# EasyEDA Pro project ProProject_触摸水晶小夜灯_2024-02-28.epro

# Schematic Schematic1
Create Date: 2024-02-10; Page Name: P1; Project Name: 触摸水晶灯; Schematic Name: Schematic1; Update Date: 2024-02-10; Company: 嘉立创EDA; Page Size: A4; Version: V1.0
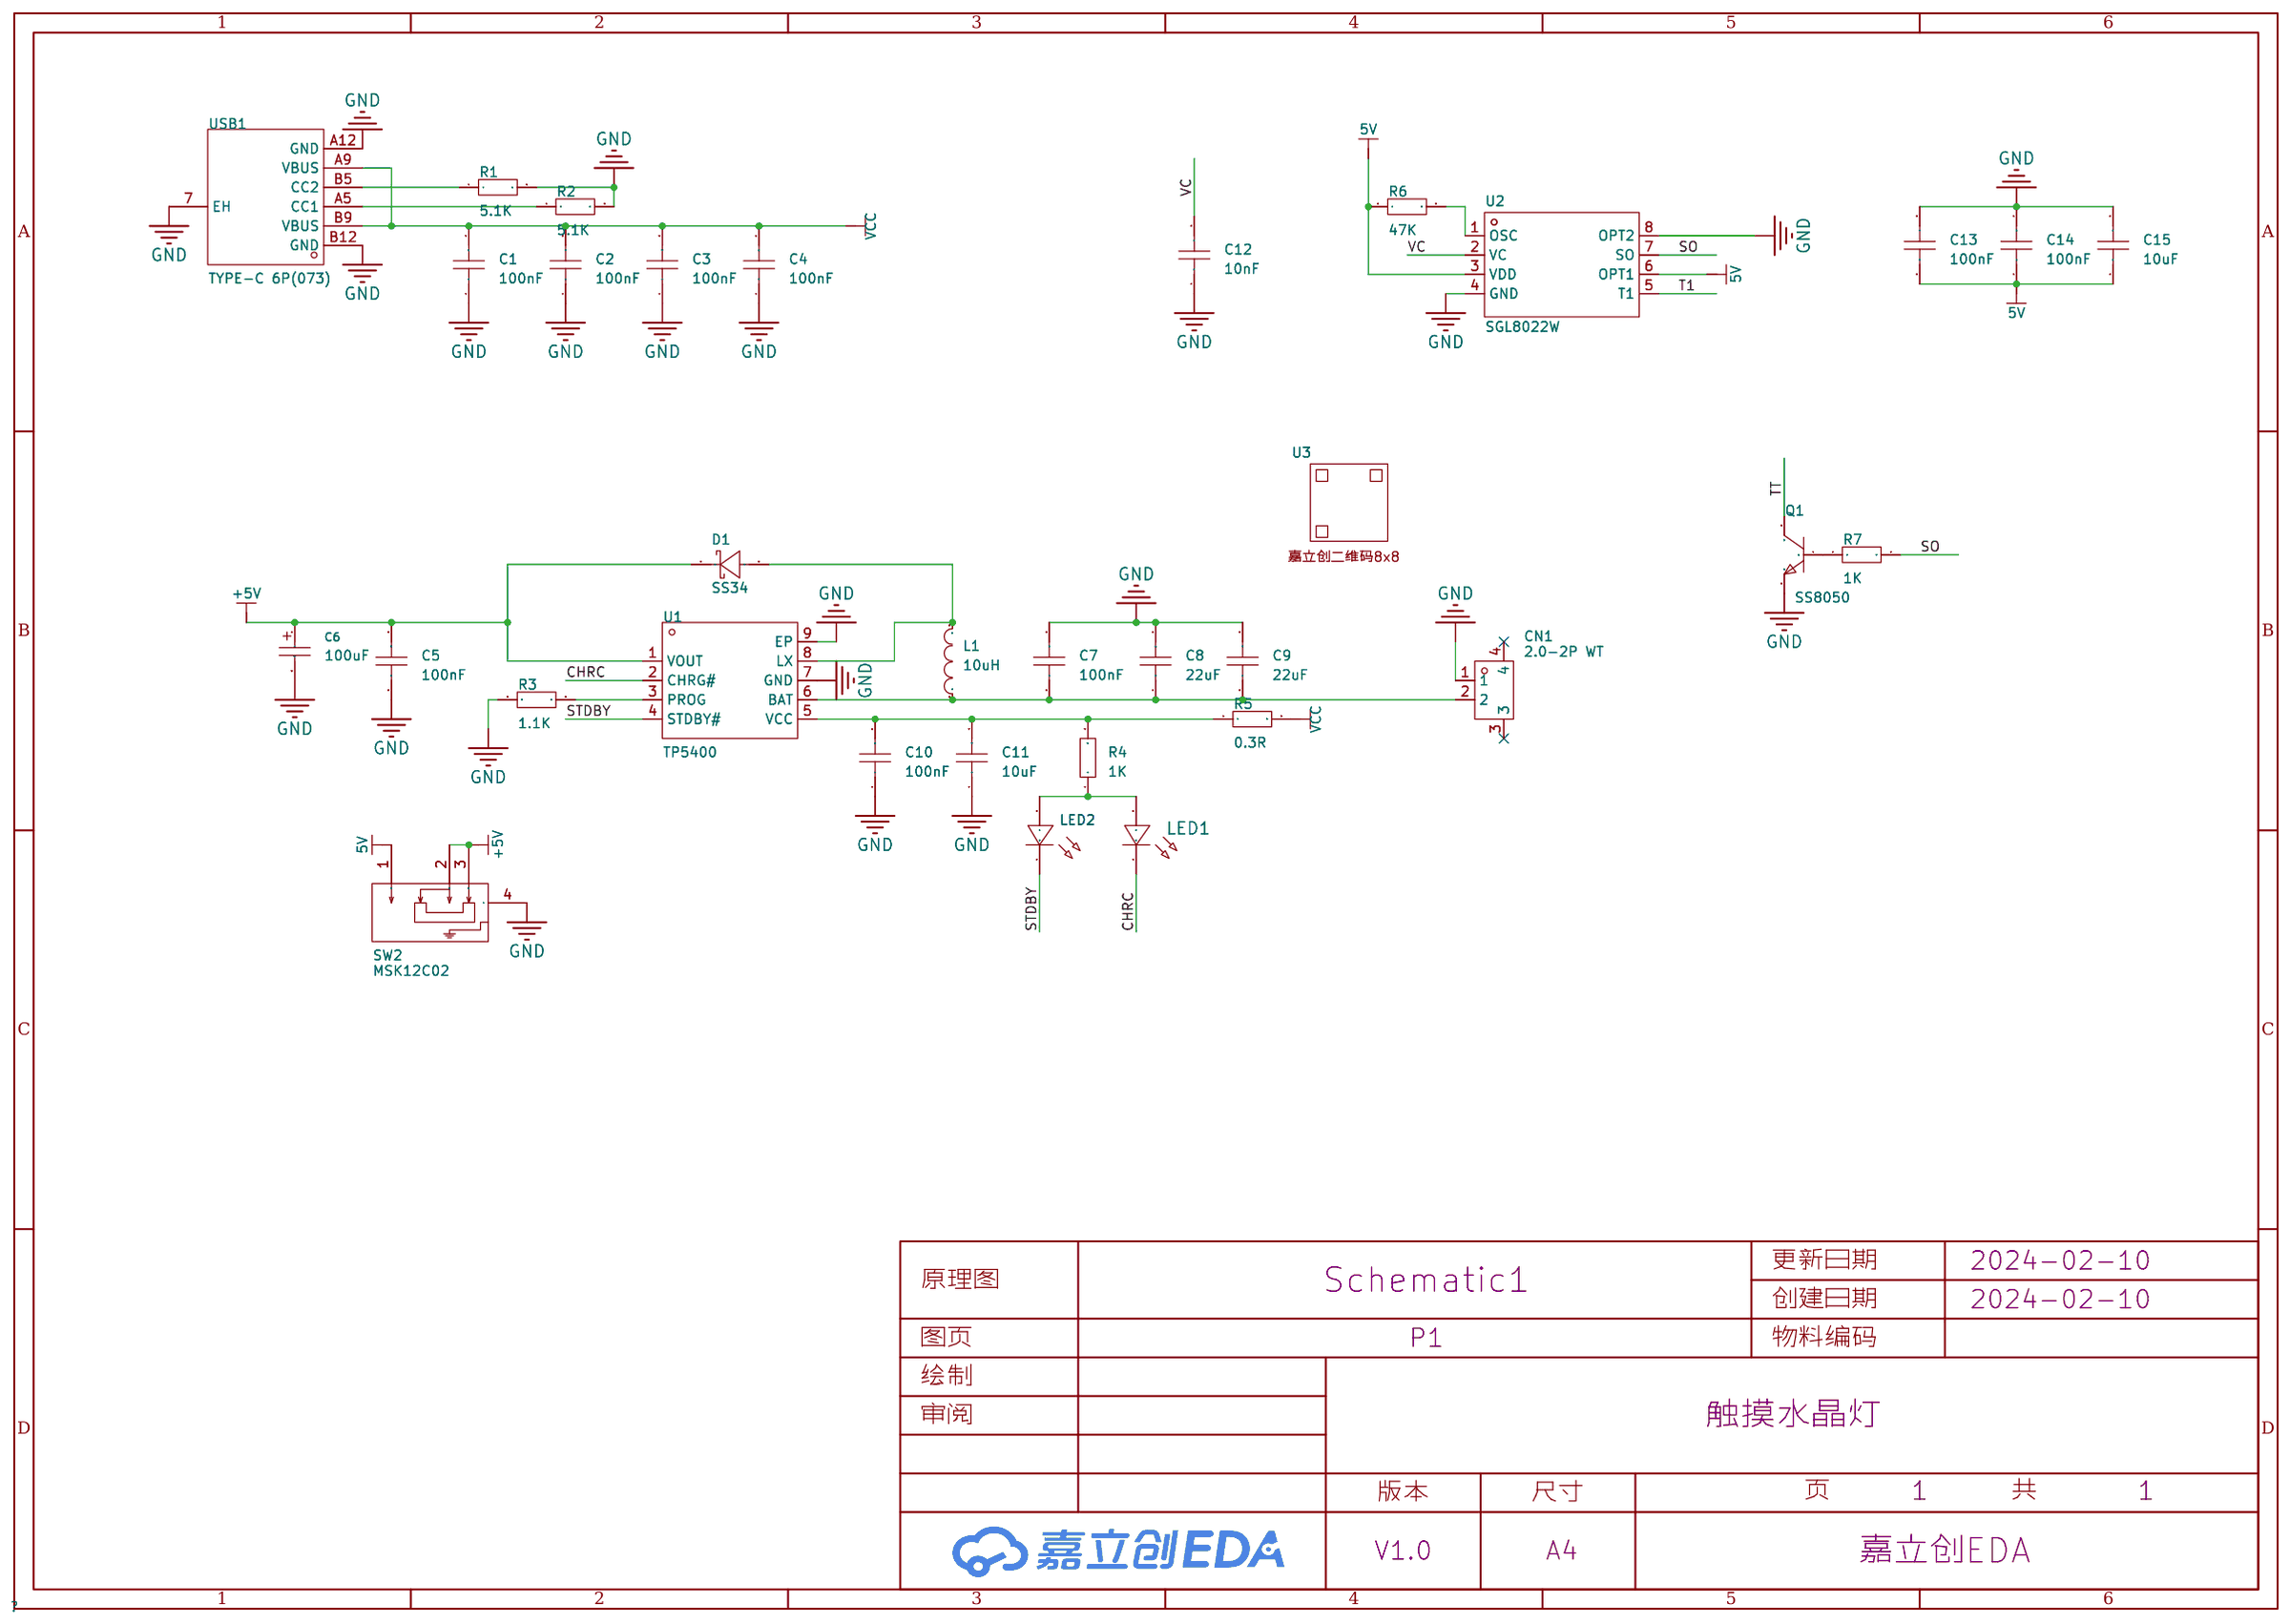
[diagram p0: schematic sheet]

## Parts
C1  100nF  [C0603]
C2  100nF  [C0603]
C3  100nF  [C0603]
C4  100nF  [C0603]
C5  100nF  [C0603]
C6  100uF  [CASE-B_3528]
C7  100nF  [C0603]
C8  22uF  [C0603]
C9  22uF  [C0603]
C10  100nF  [C0603]
C11  10uF  [C0603]
C12  10nF  [C0603]
C13  100nF  [C0603]
C14  100nF  [C0603]
C15  10uF  [C0603]
CN1  2.0-2P WT  [CONN-SMD_2.0-2PWT]
D1  SS34  [SMA_L4.3-W2.5-LS5.0-RD]
L1  10uH  [IND-SMD_L4.4-W4.2]
LED1  -  [LED_0603]
LED2  -  [LED_0603]
Q1  SS8050  [SOT-23-3_L2.9-W1.3-P1.90-LS2.4-BR]
R1  5.1K  [R0603]
R2  5.1K  [R0603]
R3  1.1K  [R0603]
R4  1K  [R0603]
R5  0.3R  [R0603]
R6  47K  [R0603]
R7  1K  [R0603]
SW2  MSK12C02  [SW-TH_MSK12C02]
U1  TP5400  [ESOP-8_L4.9-W3.9-P1.27-LS6.0-BL-EP]
U2  SGL8022W  [SOP-8_L4.9-W3.9-P1.27-LS6.0-BL]
U3  -  [JLC-QRCODE-8x8]
USB1  TYPE-C 6P(073)  [TYPE-C-SMD_TYPE-C-6P]

## Library data of the parts
C1-C5 C7-C15 = CAP_0603: Supplier Footprint: 0603
C6 = TAJB107K006RNJ: 容值:100uF;精度:±10%;额定电压:6.3V;等效串联电阻:1.7Ω@100kHz;; LCSC Part Name: 100uF ±10% 6.3V; Supplier Part: C16133; Manufacturer: Kyocera AVX; Supplier Footprint: CASE-B-3528; JLCPCB Part Class: 基础库; Datasheet: https://atta.szlcsc.com/upload/public/pdf/source/20160107/1457707750344.pdf; Supplier: LCSC; Tolerance: ±10%; Rated Voltage: 6.3V; Equivalent Series Resistance(ESR): 1.7Ω@100kHz; Operating Temperature: -55℃~+125℃
CN1 = 2.0-2P WT: 插针结构:1x2P;间距:2mm;安装方式:卧贴;参考系列:-;总PIN数:2P;排数:1;每排PIN数:2;行距:-;额定电流:2A;工作温度范围:-25℃~+85℃;; LCSC Part Name: 1x2P 间距:2mm 卧贴; Supplier Part: C668620; Manufacturer: SHOU HAN(首韩); Supplier Footprint: SMD,P=2mm,卧贴; JLCPCB Part Class: 扩展库; Datasheet: https://atta.szlcsc.com/upload/public/pdf/source/20200618/C668620_23A1268D02446CDAEF4211C80D6A413F.pdf; Supplier: LCSC; Pins Structure: 1x2P; Pitch: 2mm; Mounting Style: 卧贴; Number of Pins: 2P; Number of Rows: 1; Number of PINs Per Row: 2; Current Rating (Max): 2A; Operating Temperature Range: -25℃~+85℃
D1 = SS34_C727060: 二极管配置:独立式;正向压降(Vf):550mV@3A;直流反向耐压(Vr):40V;平均整流电流(Io):3A;; LCSC Part Name: 电压:40V 电流:3A; Supplier Part: C727060; Manufacturer: TWGMC(台湾迪嘉); Supplier Footprint: SMA(DO-214AC); JLCPCB Part Class: Extended Part; Datasheet: https://atta.szlcsc.com/upload/public/pdf/source/20200828/C727059_6599B6CAC5F3238B9C33E46794659DBE.pdf; Supplier: LCSC; Diode Configuration: 独立式; Forward Voltage (Vf@If): 550mV@3A; Reverse Voltage (Vr): 40V; Average Rectified Current (Io): 3A; Reverse Leakage Current (Ir): 500uA@40V
L1 = FXL0420-100-M: 电感值:10uH;精度:±20%;额定电流:1.6A;饱和电流(Isat):2.2A;类型:一体成型电感;; LCSC Part Name: 10uH ±20% 2.2A; Supplier Part: C177242; Manufacturer: cjiang(长江微电); Supplier Footprint: SMD,4.2x4.4mm; JLCPCB Part Class: 扩展库; Datasheet: https://atta.szlcsc.com/upload/public/pdf/source/20200117/C485363_A2440626DC7482D75DD0DD56D1883FBF.pdf; Supplier: LCSC; Tolerance: ±20%; Rated Current: 1.6A; Saturation Current (Isat): 2.2A; DC Resistance (DCR): 282mΩ; Type: 一体成型电感
LED1 = LED_0603-R: Supplier Footprint: 0603
LED2 = LED_0603-G: Supplier Footprint: 0603
Q1 = SS8050_C2150: 晶体管类型:NPN;集电极电流(Ic):1.5A;集射极击穿电压(Vceo):25V;功率(Pd):300mW;直流电流增益(hFE@Ic,Vce):200@100mA,1V;; LCSC Part Name: NPN 电流:1.5A 耐压:25V hfe=200~350; Supplier Part: C2150; Manufacturer: CJ(江苏长电/长晶); Supplier Footprint: SOT-23; JLCPCB Part Class: Basic Part; Datasheet: https://atta.szlcsc.com/upload/public/pdf/source/20230322/AEE86F4B043774EFF80CAEA14A37D9E9.pdf; Supplier: LCSC; Transistor Type: NPN; Collector Current (Ic): 1.5A; Collector-Emitter Breakdown Voltage (Vceo): 25V; Power Dissipation (Pd): 300mW; DC Current Gain (hFE@Ic,Vce): 200@100mA,1V; Transition Frequency (fT): 100MHz; Collector Cut-Off Current (Icbo): 100nA; Collector-Emitter Saturation Voltage (VCE(sat)@Ic,Ib): 500mV@800mA,80mA
R1-R7 = Res_0603: Supplier Footprint: 0603
SW2 = MSK12C02: 电路结构:单刀双掷;安装方式:卧贴;开关颜色:-;额定电流(DC):50mA;额定电压(DC):12V;额定电流(AC):-;额定电压(AC):-;机械寿命:1万次;; LCSC Part Name: 两档侧拨贴片 7脚 滑动开关; Supplier Part: C431540; Manufacturer: SHOU HAN(首韩); Supplier Footprint: SMD; JLCPCB Part Class: 扩展库; Datasheet: https://atta.szlcsc.com/upload/public/pdf/source/20190925/C431540_89155AEF0758B9AD1B2D805F83FB12E3.pdf; Supplier: LCSC; Circuit: 单刀双掷; Pin Style: SMD接片; Switch Length: 8mm; Switch Width: 2.8mm; Switch Height: 1.4mm; Mounting Style: 卧贴; Current Rating (DC): 50mA; Voltage Rating (DC): 12V; Mechanical Life: 1万次; Operating Temperature: -20℃~+70℃
U1 = TP5400: Supplier Part: C2891434; Manufacturer: TOPPOWER(南京拓微); Supplier Footprint: ESOP-8; JLCPCB Part Class: 扩展库; Datasheet: https://atta.szlcsc.com/upload/public/pdf/source/20210909/352D9D40D77A1DD73F7904E364EF004B.pdf; Supplier: LCSC
U2 = SGL8022W: 通道数:1;; Supplier Part: C81650; Manufacturer: SIGMA(希格玛); Supplier Footprint: SOP-8; JLCPCB Part Class: 扩展库; Datasheet: https://atta.szlcsc.com/upload/public/pdf/source/20170620/1497944870793.pdf; Supplier: LCSC; The Channel Number: 1
U3 = 嘉立创二维码8x8
USB1 = TYPE-C 6P(073): 连接器类型:Type-C;标准:-;公母:母;端口数量:1;触点数量:6P;安装方式:卧贴;额定电流 - 电源:5A;工作温度范围:-25℃~+85℃;; LCSC Part Name: Type-C 母 卧贴; Supplier Part: C668623; Manufacturer: SHOU HAN(首韩); Supplier Footprint: SMD; JLCPCB Part Class: 扩展库; Datasheet: https://atta.szlcsc.com/upload/public/pdf/source/20200618/C668623_A4B260DED7AC1949BAC6AE39E9F4CD80.pdf; Supplier: LCSC; Connector Type: Type-C; Gender: 母; Number of Ports: 1; Number of Contacts: 6P; Mounting Style: 卧贴; Current Rating - Power (Max): 5A; Operating Temperature Range: -25℃~+85℃

## Nets
5V: C13.1 C14.1 C15.1 R6.1 SW2.1 U2.3(VDD) U2.6(OPT1)
+5V: C5.2 C6.1 D1.1(C) SW2.2 SW2.3 U1.1(VOUT)
GND: C1.1 C2.1 C3.1 C4.1 C5.1 C6.2 C7.2 C8.2 C9.2 C10.1 C11.1 C12.1 C13.2 C14.2 C15.2 CN1.1 Q1.2(E) R1.2 R2.2 R3.1 SW2.4 U1.7(GND) U1.9(EP) U2.4(GND) U2.8(OPT2) USB1.7(EH) USB1.A12(GND) USB1.B12(GND)
VCC: C1.2 C2.2 C3.2 C4.2 R5.2 USB1.A9(VBUS) USB1.B9(VBUS)
CHRC: LED1.1(C) U1.2(CHRG#)
SO: R7.2 U2.7(SO)
STDBY: LED2.1(C) U1.4(STDBY#)
T1: U2.5(T1)
TT: Q1.3(C)
VC: C12.2 U2.2(VC)
$1N577: R1.1 USB1.B5(CC2)
$1N583: R2.1 USB1.A5(CC1)
$1N1194: R3.2 U1.3(PROG)
$1N1614: D1.2(A) L1.2 U1.8(LX)
$1N1820: C7.1 C8.1 C9.1 CN1.2 L1.1 U1.6(BAT)
$1N2082: C10.2 C11.2 R4.2 R5.1 U1.5(VCC)
$1N2235: LED1.2(A) LED2.2(A) R4.1
$1N2524: R6.2 U2.1(OSC)
$1N3000: Q1.1(B) R7.1

Not connected (* = marked no-connect by the designer): CN1 3* 4*

# Schematic Schematic2
Create Date: 2024-02-11; Page Name: P1; Project Name: 触摸水晶灯; Schematic Name: Schematic2; Update Date: 2024-02-11; Company: 嘉立创EDA; Page Size: A4; Version: V1.0
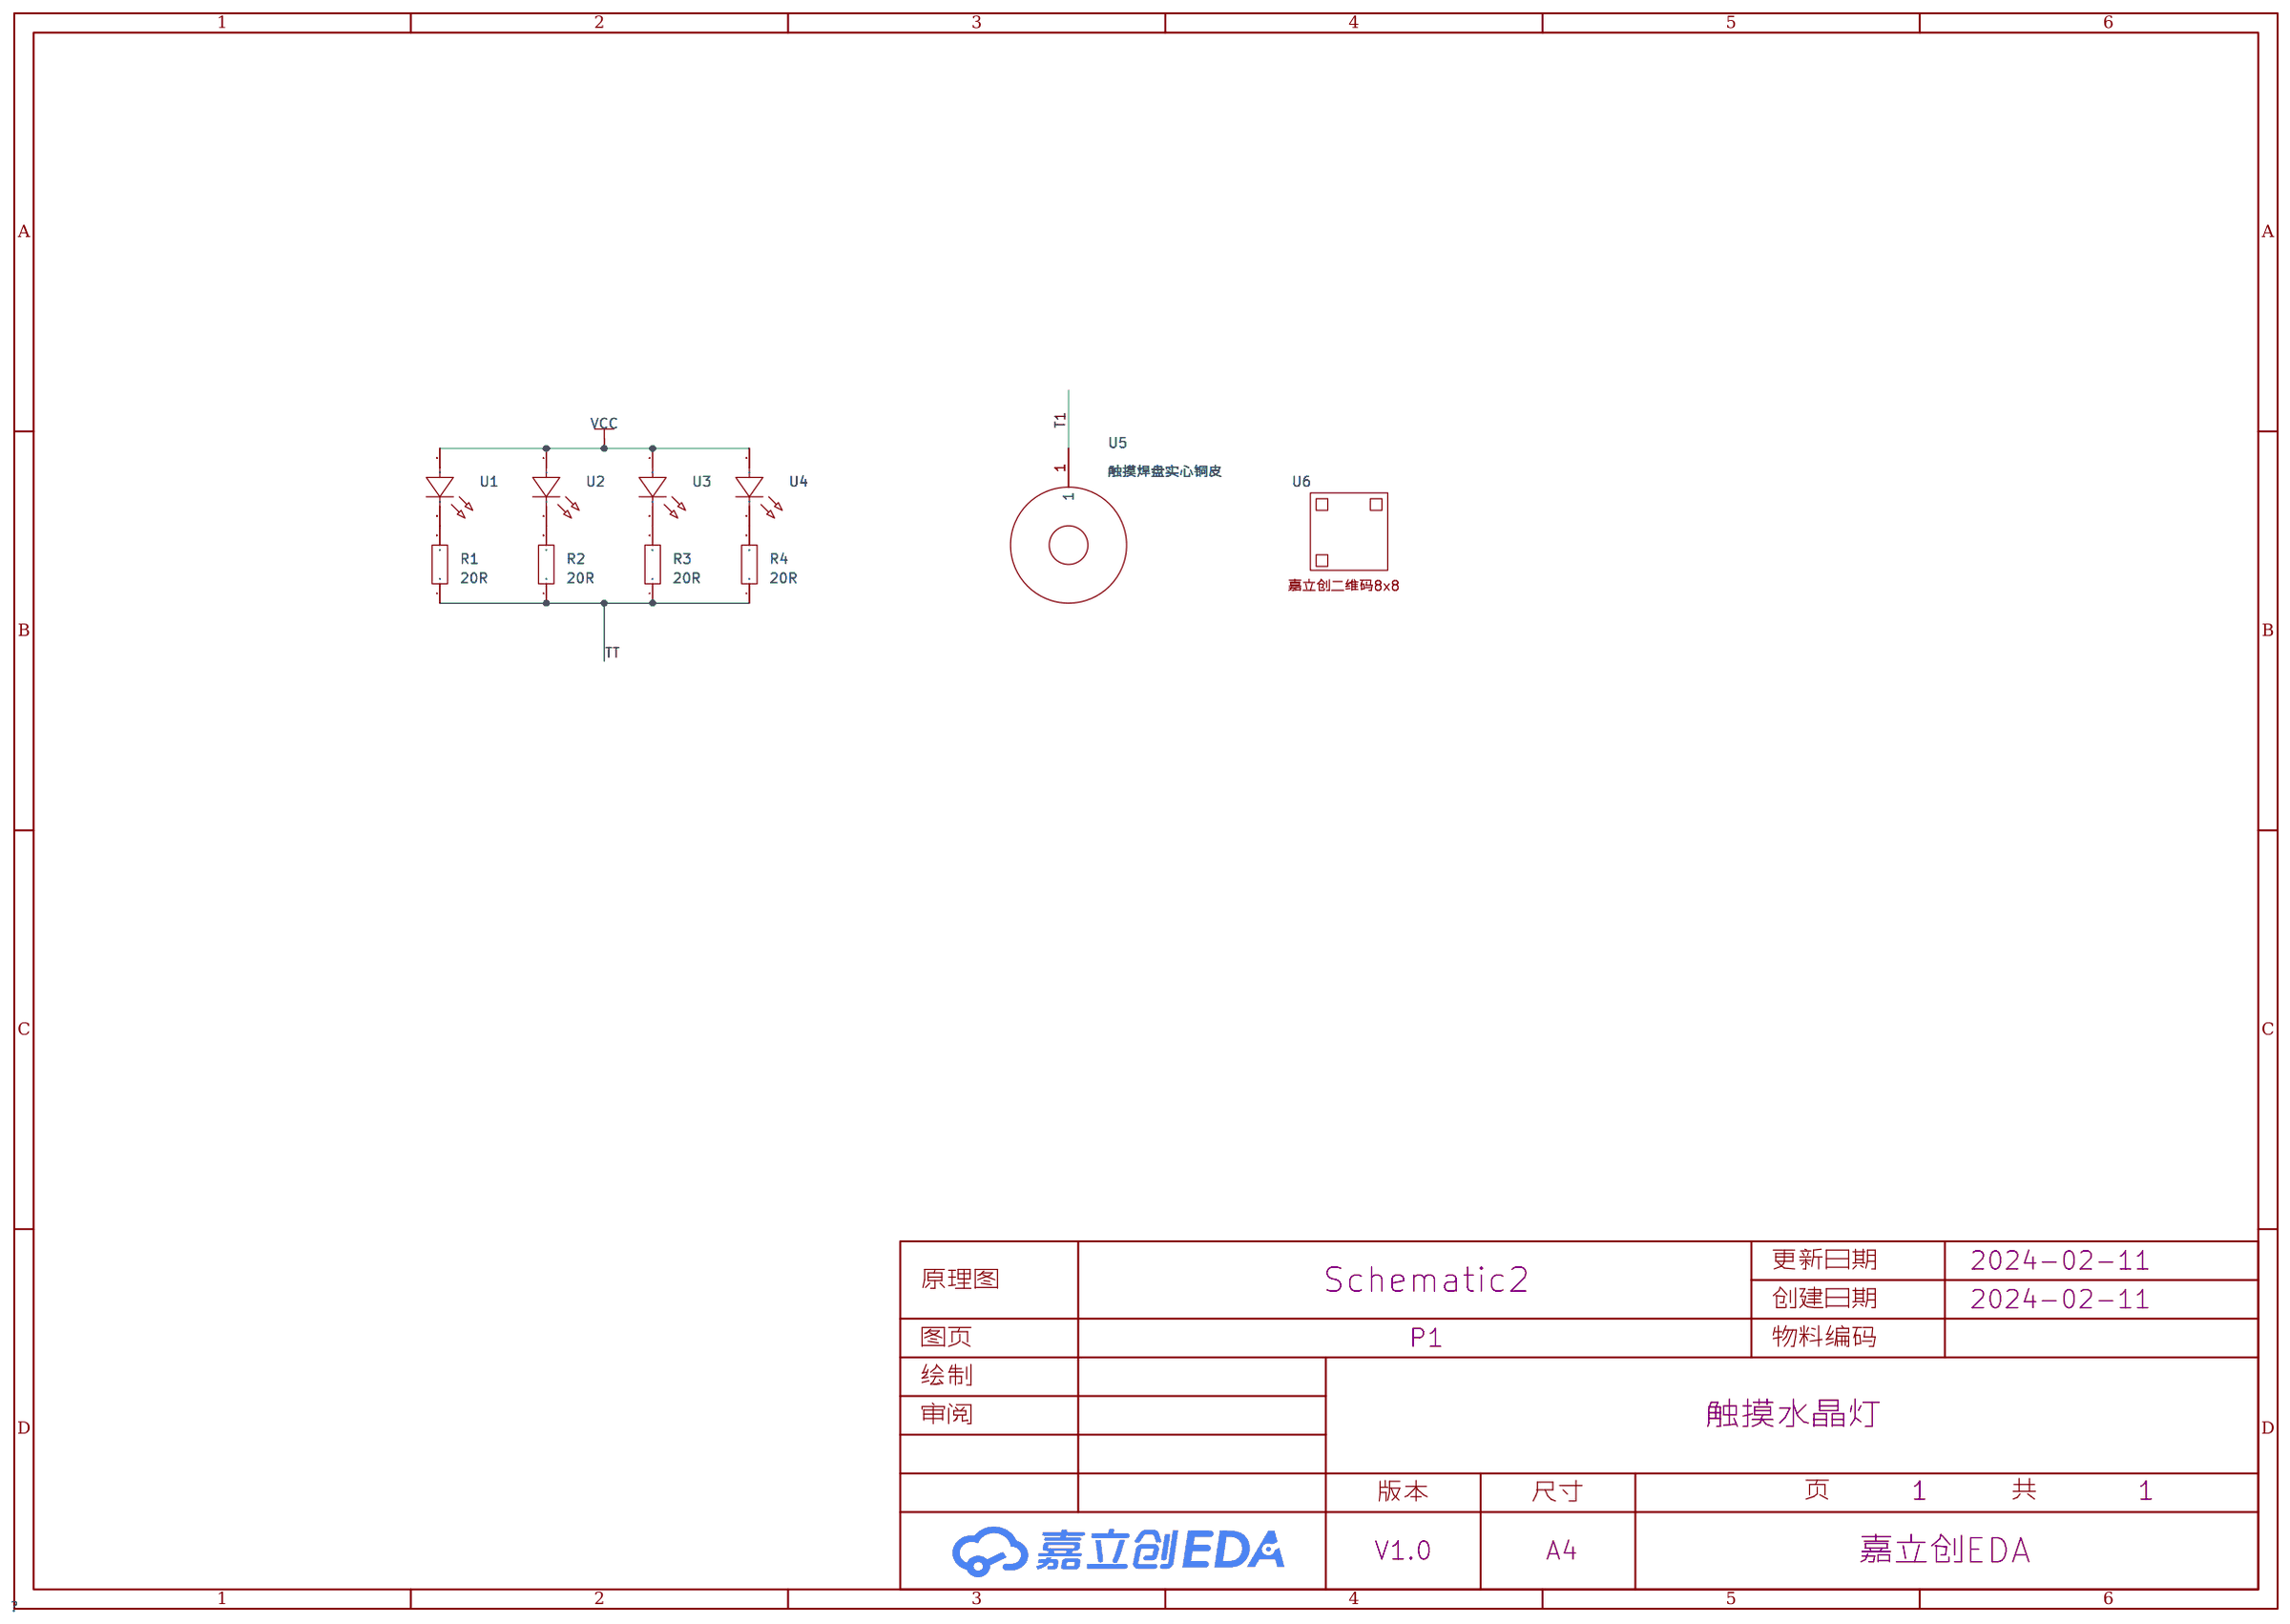
[diagram p1: schematic sheet]

## Parts
R1  20R  [R0603]
R2  20R  [R0603]
R3  20R  [R0603]
R4  20R  [R0603]
U1  -  [26mm]
U2  -  [26mm]
U3  -  [26mm]
U4  -  [26mm]
U5  触摸焊盘实心铜皮  [触摸焊盘]
U6  -  [JLC-QRCODE-8x8]

## Library data of the parts
R1-R4 = Res_0603: Supplier Footprint: 0603
U1-U4 = 26mm 不挖槽
U5 = 触摸焊盘实心铜皮: Manufacturer: no; Manufacturer Part: no; Supplier Part: no; link: no
U6 = 嘉立创二维码8x8

## Nets
VCC: U1.1(A) U2.1(A) U3.1(A) U4.1(A)
T1: U5.1
TT: R1.1 R2.1 R3.1 R4.1
$1N154: R1.2 U1.2(K)
$1N282: R2.2 U2.2(K)
$1N308: R3.2 U3.2(K)
$1N334: R4.2 U4.2(K)

# Board PCB1
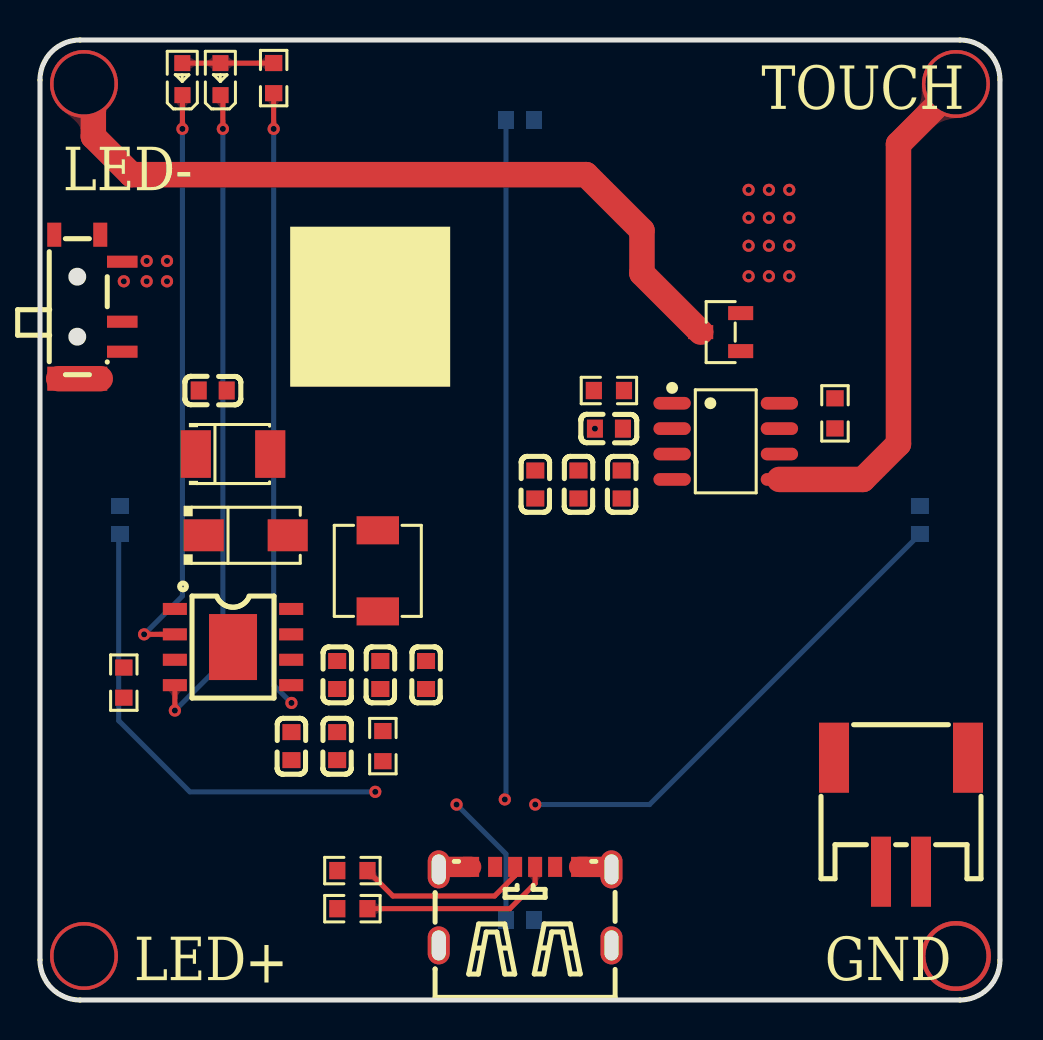
[diagram p2: board, top side]
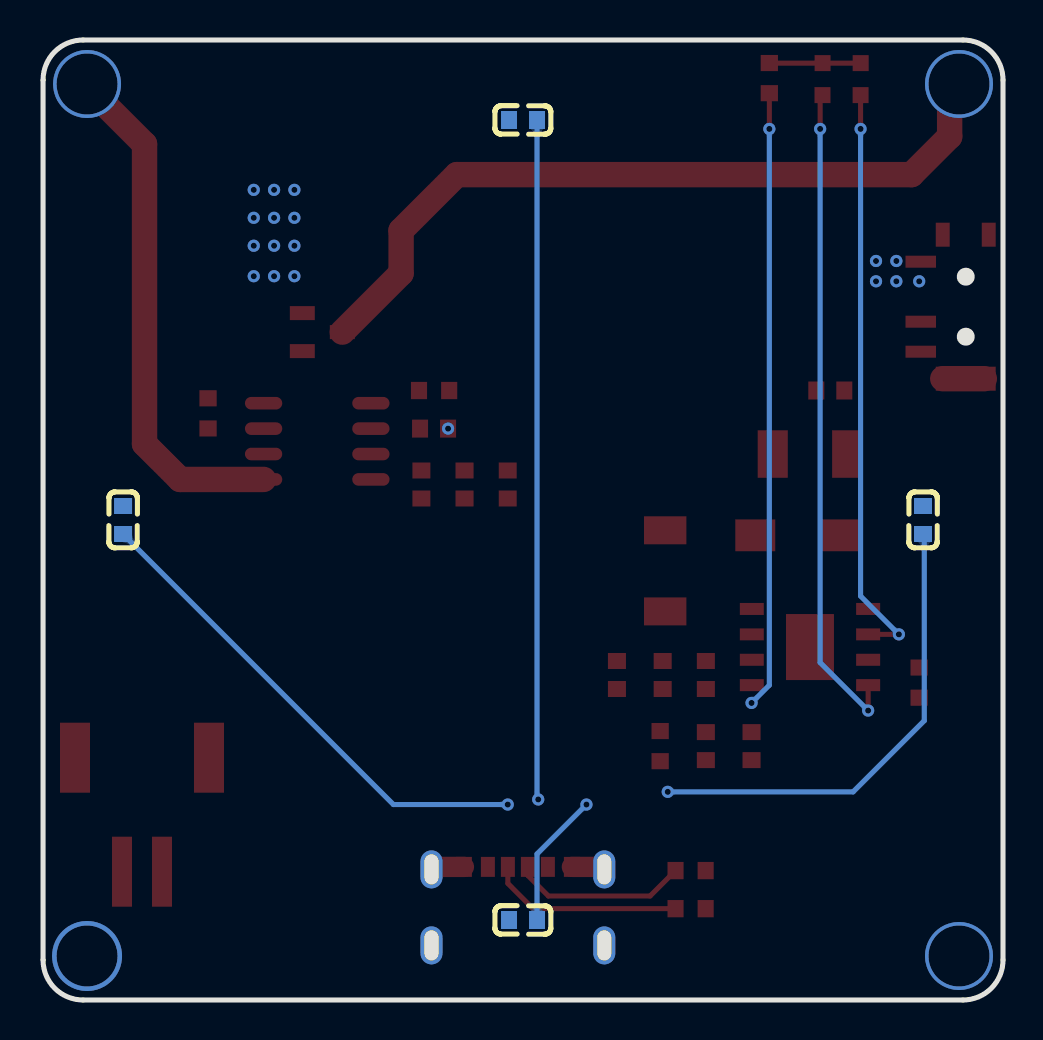
[diagram p3: board, bottom side, seen from below]

Outline 48 x 48 mm; copper layers: Top Layer, Bottom Layer. Coordinates in mm from the lower left corner of the outline.
Outline path: 0,46 0,2 arc(0.59,0.59) 2,0 46,0 arc(47.41,0.59) 48,2 48,46 arc(47.41,47.41) 46,48 2,48 arc(0.59,47.41) 0,46
Stack: Top Layer 0.035mm / Dielectric1 1.51mm FR4 er 4.5 / Bottom Layer 0.035mm

## Design rules (mm)
template: 自定义配置
spacing copperThickness1oz (default): track to track 0.102, other pairs 0.152 to 0.3
spacing copperThickness2oz: track to track 0.203, other pairs 0.152 to 0.3
track width copperThickness1oz (default): min 0.127, default 0.254, max 2.54
track width copperThickness2oz: min 0.203, default 0.254, max 2.54
differential pair differentialPair (default): width min 0.127, default 0.254, max 2.54; gap min 0.152, default 0.152
via viaSize (default): diameter min 0.5, default 0.61, max 10; hole min 0.3, default 0.305, max 6.3

## Placement (name value [footprint] x y rotation side)
C1  100nF  [C0603]  4 24 270 bottom
C2  100nF  [C0603]  24 4 180 bottom
C3  100nF  [C0603]  24 44 180 bottom
C4  100nF  [C0603]  44 24 270 bottom
C5  100nF  [C0603]  8.64 30.47 180 top
C6  100uF  [CASE-B_3528]  9.65 27.3 0 top
C7  100nF  [C0603]  14.86 16.25 270 top
C8  22uF  [C0603]  17.02 16.25 270 top
C9  22uF  [C0603]  19.3 16.25 270 top
C10  100nF  [C0603]  12.57 12.69 90 top
C11  10uF  [C0603]  14.86 12.69 90 top
C12  10nF  [C0603]  28.45 28.57 0 top
C13  100nF  [C0603]  29.08 25.78 270 top
C14  100nF  [C0603]  26.92 25.78 270 top
C15  10uF  [C0603]  24.76 25.78 270 top
CN1  2.0-2P WT  [CONN-SMD_2.0-2PWT]  43.05 9.27 0 top
D1  SS34  [SMA_L4.3-W2.5-LS5.0-RD]  10.29 23.23 0 top
L1  10uH  [IND-SMD_L4.4-W4.2]  16.89 21.46 270 top
LED1  -  [LED_0603]  7.11 46.09 90 top
LED2  -  [LED_0603]  9.02 46.09 90 top
Q1  SS8050  [SOT-23-3_L2.9-W1.3-P1.90-LS2.4-BR]  34.04 33.39 0 top
R1  5.1K  [R0603]  15.62 4.57 180 top
R2  5.1K  [R0603]  15.62 6.47 180 top
R3  1.1K  [R0603]  4.19 15.87 90 top
R4  1K  [R0603]  11.68 46.09 270 top
R5  0.3R  [R0603]  17.15 12.69 270 top
R6  47K  [R0603]  28.45 30.47 0 top
R7  1K  [R0603]  39.75 29.33 270 top
SW2  MSK12C02  [SW-TH_MSK12C02]  2.41 34.67 270 top
U1  TP5400  [ESOP-8_L4.9-W3.9-P1.27-LS6.0-BL-EP]  9.65 17.65 270 top
U2  SGL8022W  [SOP-8_L4.9-W3.9-P1.27-LS6.0-BL]  34.29 27.93 270 top
U3  -  [JLC-QRCODE-8x8]  16.51 34.67 0 top
USB1  TYPE-C 6P(073)  [TYPE-C-SMD_TYPE-C-6P]  24.26 4.69 0 top

## Footprints (pads in the part's own frame, mm; a bottom-side part is the same pattern mirrored in y, then rotated)
C0603
  rect 0.8x0.9 smd: 1(-0.7,0) 2(0.7,0)
CASE-B_3528
  rect 1.506x2.376 smd: 1(-1.861,0) 2(1.861,0)
CONN-SMD_2.0-2PWT
  rect 1x3.5 smd: 1(1,-2.85) 2(-1,-2.85)
  rect 1.5x3.5 smd: 3(3.35,2.85) 4(-3.35,2.85)
ESOP-8_L4.9-W3.9-P1.27-LS6.0-BL-EP
  rect 0.6x1.2 smd: 1(-1.905,-2.909) 2(-0.635,-2.909) 3(0.635,-2.909) 4(1.905,-2.909) 5(1.905,2.909) 6(0.635,2.909) 7(-0.635,2.909) 8(-1.905,2.909)
  rect 3.3x2.4 smd: 9(0,0)
IND-SMD_L4.4-W4.2
  rect 1.4x2.12 smd: 1(2.028,0) 2(-2.028,0)
LED_0603
  rect 0.8x0.8 smd: 1(-0.851,-0.01) 2(0.75,-0.005)
R0603
  rect 0.806x0.864 smd: 1(-0.753,0) 2(0.753,0)
SMA_L4.3-W2.5-LS5.0-RD
  rect 2x1.593 smd: 1(-2.1,0) 2(2.1,0)
SOP-8_L4.9-W3.9-P1.27-LS6.0-BL
  oval 0.63x1.865 smd: 1(-1.905,-2.683) 2(-0.635,-2.683) 3(0.635,-2.683) 4(1.905,-2.683) 5(1.905,2.683) 6(0.635,2.683) 7(-0.635,2.683) 8(-1.905,2.683)
SOT-23-3_L2.9-W1.3-P1.90-LS2.4-BR
  rect 1.25x0.7 smd: 1(1,-0.95) 2(1,0.95) 3(-1,0)
SW-TH_MSK12C02
  rect 0.6x1.524 smd: 1(-2.25,1.7) 2(0.75,1.7) 3(2.25,1.7)
  rect 1.2x0.7 smd: 4(-3.6,0.6) 4(-3.6,-1.7) 4(3.6,0.6) 4(3.6,-1.7)
TYPE-C-SMD_TYPE-C-6P
  oval 1.1x1.9 hole 0.7x1.5: 7(-4.32,1.837) 7(-4.32,-1.962) 7(4.32,1.837) 7(4.32,-1.962)
  rect 0.7x1 smd: A5(-0.5,1.962) A9(1.5,1.962) B5(0.5,1.962) B9(-1.5,1.962)
  rect 0.8x1 smd: A12(2.7,1.962) B12(-2.7,1.962)

## Nets
As in the schematic.

Pads without a net: CN1 3 4

## Via types
v1: diameter 3.5, hole 3.05, Top Layer to Bottom Layer, 1 via
v2: diameter 0.61, hole 0.305, Top Layer to Bottom Layer, 28 vias
v3: diameter 3.4, hole 3.05, Top Layer to Bottom Layer, 3 vias

## Routing (per net, layer and track width the routed paths; a pad name or vN(x,y) marks a point on that pad's centre or on a via; arc(x,y) is an arc through that point)
5V:
  vias: v2(4.19,35.94) v2(5.33,36.95) v2(5.33,35.94) v2(6.35,36.95) v2(6.35,35.94) v3(2.2,2.2)
GND: length 5.1
  Top Layer w1.016: USB1.A12 28.45,6.66 ; 21.56,6.66 20.06,6.66
  Top Layer w1.27: 3.01,31.06 0.94,31.06
  vias: v1(45.8,2.2) v2(27.75,28.57) v2(35.43,40.51) v2(35.43,39.11) v2(35.43,37.71) v2(35.43,36.19) v2(36.45,40.51) v2(36.45,39.11) v2(36.45,37.71) v2(36.45,36.19) v2(37.47,40.51) v2(37.47,39.11) v2(37.47,37.71) v2(37.47,36.19)
VCC: length 89.3
  Bottom Layer w0.254: C1.2 3.94,23.24 3.94,13.96 7.49,10.41 v2(16.76,10.41) ; C3.2 23.3,10.09 v2(23.24,10.03) ; 44.01,23.3 30.48,9.77 v2(24.76,9.77) ; C2.2 23.3,7.3 v2(20.83,9.77)
CHRC: length 29.3
  Top Layer w0.254: U1.2 v2(5.21,18.28) ; LED1.1 v2(7.12,43.56)
  Bottom Layer w0.254: v2(5.21,18.28) 7.12,20.2 v2(7.12,43.56)
STDBY: length 33.1
  Top Layer w0.254: v2(9.14,43.56) 9.14,45.13 LED2.1 ; U1.4 v2(6.74,14.47)
  Bottom Layer w0.254: v2(9.14,43.56) 9.14,16.87 v2(6.74,14.47)
T1: length 25.3
  Top Layer w1.27: 45.47,45.33 42.93,42.79 42.93,27.81 41.15,26.03 U2.5
  vias: v3(45.8,45.8)
TT: length 38
  Top Layer w1.27: Q1.3 30.1,36.33 30.1,38.47 27.31,41.27 4.57,41.27 2.67,43.17 2.67,45.46
  vias: v3(2.2,45.8)
$1N577: length 9.7
  Top Layer w0.254: USB1.B5 24.76,5.83 23.5,4.57 R1.1
$1N583: length 8.8
  Top Layer w0.254: R2.1 17.64,5.2 22.73,5.2 23.76,6.22 USB1.A5
$1N2082: length 30.9
  Top Layer w0.254: R4.2 v2(11.68,43.56)
  Bottom Layer w0.254: v2(11.68,43.56) 11.68,15.74 v2(12.57,14.85)
$1N2235: length 4.6
  Top Layer w0.254: LED1.2 LED2.2 11.68,46.84 R4.1

## Copper pours and planes (outline as drawn; the poured copper is in the pictures)
5V on Top Layer: 2.67,37.46 28.45,37.46 28.45,29.62 26.56,29.62 26.56,27.55 30.23,27.55 30.23,27.86 38.1,27.86 38.1,26.61 30.35,26.61 30.35,25.74 22.01,25.74 21.97,25.78 21.97,35.17 2.67,35.17
5V on Bottom Layer: 0.46,37.19 3.43,37.19 3.43,2.15 0.46,2.15
5V on Bottom Layer: 0.64,37.42 6.86,37.42 6.86,35.3 0.64,35.3
+5V on Top Layer: 8.13,18.92 8.13,20.95 10.1,20.95 10.1,29.2 8.63,29.2 8.63,34.79 2.07,34.79 2.07,18.92
GND on Top Layer: -5.84,49.91 52.45,49.91 52.45,-2.93 -5.84,-2.93
GND on Bottom Layer: -5.59,50.03 58.67,50.03 58.67,-6.86 -5.59,-6.86
VCC on Top Layer: 16.13,12.69 22.18,12.69 22.18,10.53 26.42,10.53 26.42,5.62 16.13,5.62
SO on Top Layer: 35.94,29.2 40.96,29.2 40.96,27.68 38.61,27.68 38.61,27.99 35.94,27.99
VC on Top Layer: 28.45,29.28 30.03,29.28 30.1,29.21 30.1,28.95 32.77,28.95 32.77,27.93 30.12,27.93 30.1,27.91 30.1,27.68 28.46,27.68 28.45,27.69
$1N1194 on Top Layer: 8.13,17.65 2.26,17.65 2.26,15.74 5.26,15.74 5.26,16.38 8.12,16.38 8.13,16.38
$1N1614 on Top Layer: 10.29,24.64 10.29,20.38 11.5,20.38 11.56,20.44 11.56,18.89 13.59,18.89 13.59,21.46 19.07,21.46 19.07,24.63 19.07,24.64
$1N1820 on Top Layer: 43.18,4.44 43.18,8.76 34.93,8.76 34.93,19.04 31.24,19.04 31.24,4.44
$1N1820 on Top Layer: 11.94,17.65 13.72,17.65 13.72,21.28 34.93,21.28 34.93,16.25 13.8,16.25 13.8,16.55 11.95,16.55 11.94,16.56
$1N2082 on Top Layer: 11.94,16.38 13.59,16.38 13.59,14.34 18.37,14.34 18.41,14.3 18.41,12.82 11.86,12.82 11.86,16.3
$1N2524 on Top Layer: 28.45,31.31 30.35,31.31 30.35,30.48 32.77,30.48 32.77,29.15 30.23,29.15 30.23,29.48 28.45,29.48 28.45,29.48
$1N3000 on Top Layer: 34.05,33.05 41.28,33.05 41.28,29.46 38.39,29.46 38.39,30.86 34.02,30.86 34.02,33.02

Small or netless copper shapes (teardrops, artwork), in the pictures only: 21 on Top Layer, 14 on Bottom Layer

## Text on the board
Top Silkscreen Layer: LED- | LED+ | TOUCH | GND

# Board PCB2
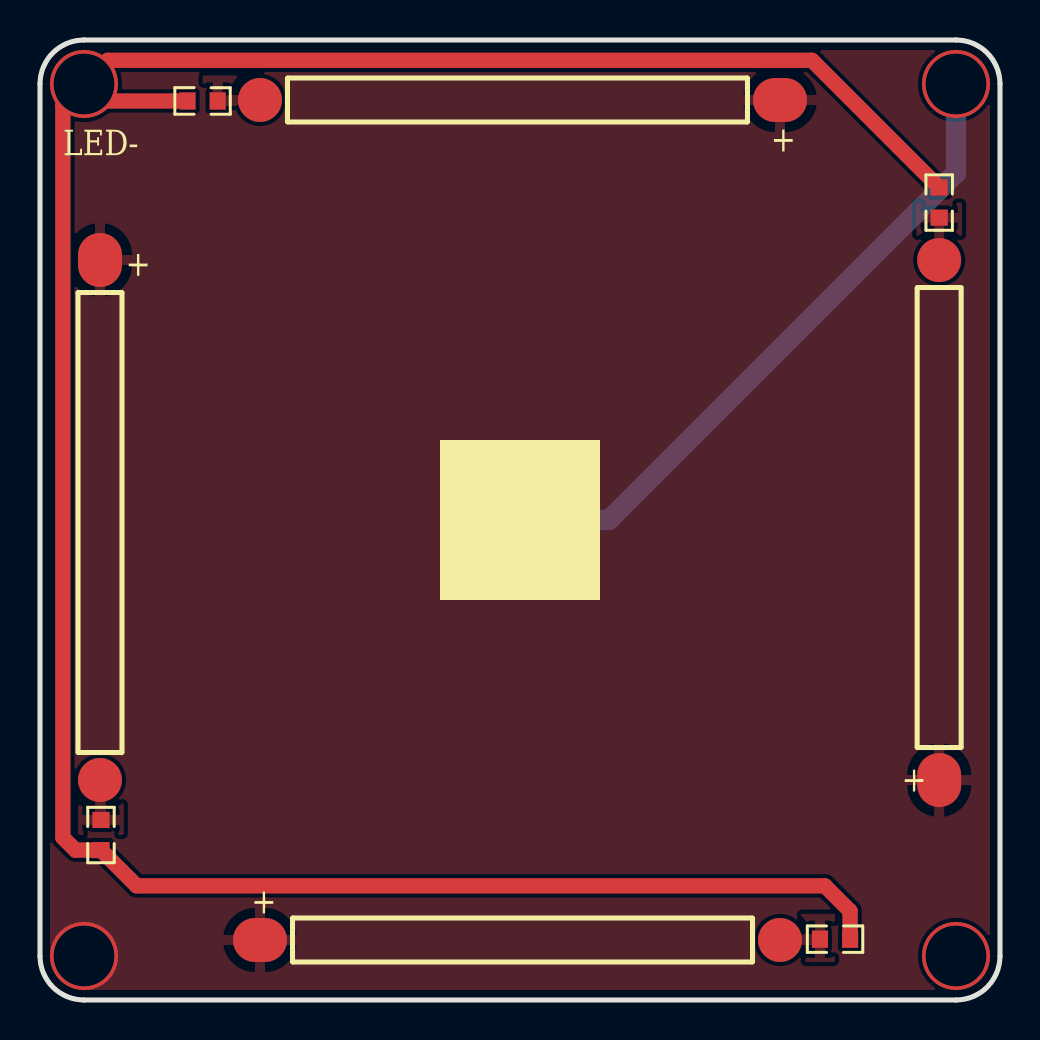
[diagram p4: board, top side]
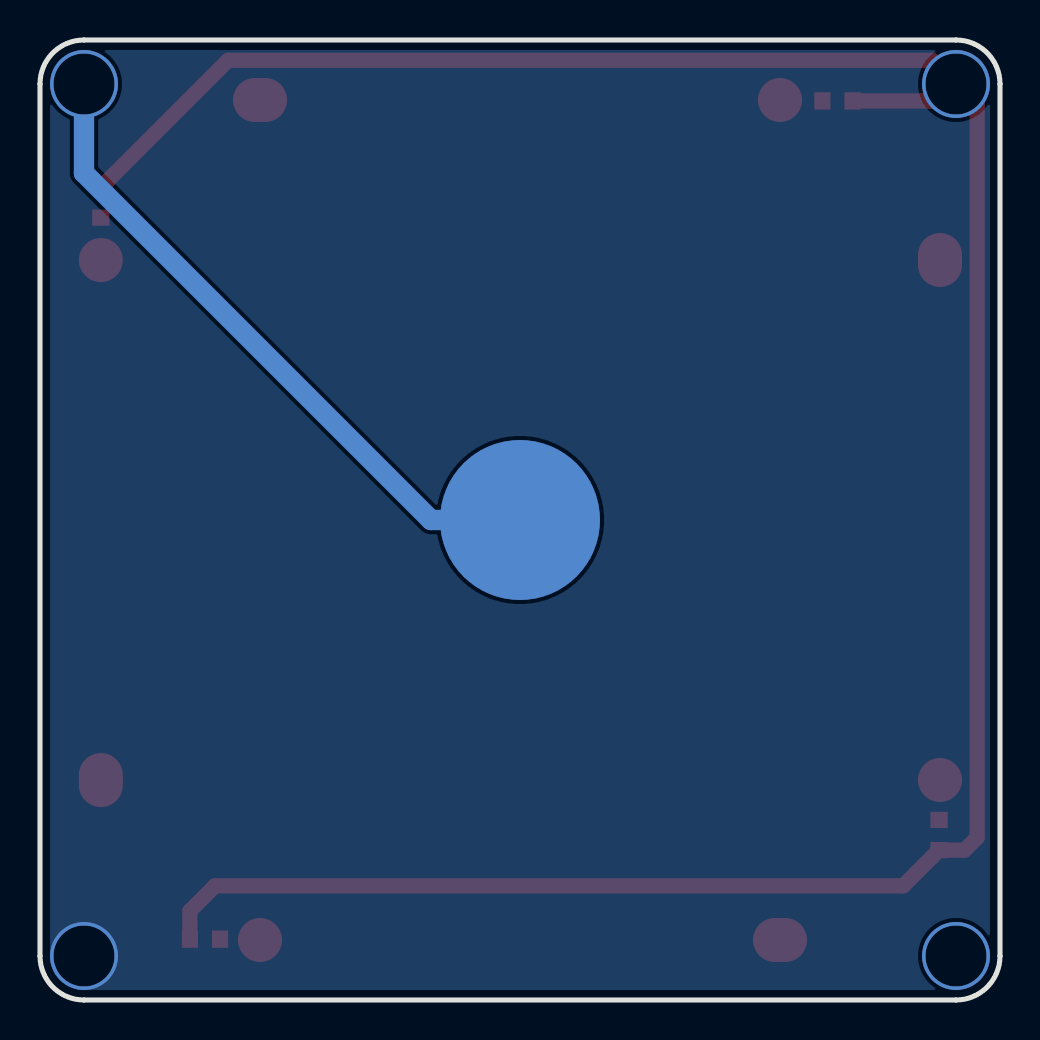
[diagram p5: board, bottom side, seen from below]

Outline 48 x 48 mm; copper layers: Top Layer, Bottom Layer. Coordinates in mm from the lower left corner of the outline.
Outline path: 0,45.8 0,2.2 arc(0.64,0.64) 2.2,0 45.8,0 arc(47.36,0.64) 48,2.2 48,45.8 arc(47.36,47.36) 45.8,48 2.2,48 arc(0.64,47.36) 0,45.8
Stack: Top Layer 0.035mm / Dielectric1 1.51mm FR4 er 4.5 / Bottom Layer 0.035mm

## Design rules (mm)
template: 自定义配置
spacing copperThickness1oz (default): track to track 0.102, other pairs 0.152 to 0.3
spacing copperThickness2oz: track to track 0.203, other pairs 0.152 to 0.3
track width copperThickness1oz (default): min 0.127, default 0.254, max 2.54
track width copperThickness2oz: min 0.203, default 0.254, max 2.54
differential pair differentialPair (default): width min 0.127, default 0.254, max 2.54; gap min 0.152, default 0.152
via viaSize (default): diameter min 0.5, default 0.61, max 10; hole min 0.3, default 0.305, max 6.3

## Placement (name value [footprint] x y rotation side)
R1  20R  [R0603]  8.13 44.95 0 top
R2  20R  [R0603]  39.75 3.04 180 top
R3  20R  [R0603]  3.05 8.25 90 top
R4  20R  [R0603]  44.96 39.87 270 top
U1  -  [26mm]  24 45 180 top
U2  -  [26mm]  24 3 0 top
U3  -  [26mm]  3 24 270 top
U4  -  [26mm]  44.96 24 90 top
U5  触摸焊盘实心铜皮  [触摸焊盘]  24 24 180 bottom
U6  -  [JLC-QRCODE-8x8]  24 24 0 top

## Footprints (pads in the part's own frame, mm; a bottom-side part is the same pattern mirrored in y, then rotated)
26mm
  oval 2.7x2.2 smd: 1(-13,0)
  round 2.2 smd: 2(13,0)
R0603
  rect 0.806x0.864 smd: 1(-0.753,0) 2(0.753,0)
触摸焊盘
  round 1 smd: 1(-3.556,0)

## Nets
As in the schematic.

## Via types
v1: diameter 3.4, hole 3.05, Top Layer to Bottom Layer, 4 vias

## Routing (per net, layer and track width the routed paths; a pad name or vN(x,y) marks a point on that pad's centre or on a via; arc(x,y) is an arc through that point)
GND:
  vias: v1(45.8,2.2)
VCC:
  vias: v1(2.2,2.2)
T1: length 29.9
  Bottom Layer w1.016: v1(45.8,45.8) 45.8,41.35 28.45,24 U5.1
TT: length 131.8
  Top Layer w0.762: R1.1 3.05,44.95 v1(2.2,45.8) ; v1(2.2,45.8) 3.38,46.98 38.6,46.98 R4.1 ; v1(2.2,45.8) 1.14,44.74 1.14,8.12 1.77,7.5 R3.1 4.83,5.71 39.24,5.71 40.5,4.45 R2.1

## Copper pours and planes (outline as drawn; the poured copper is in the pictures)
GND on Bottom Layer: -2.67,50.16 50.55,50.16 50.55,-1.91 -2.67,-1.91
VCC on Top Layer: -5.72,52.19 54.61,52.19 54.61,-4.2 -5.72,-4.2
$1N154 on Top Layer: 8.13,46.22 12.06,46.22 12.06,43.94 8.13,43.94
$1N282 on Top Layer: 36.07,4.31 39.75,4.31 39.75,1.9 36.07,1.9
$1N308 on Top Layer: 1.91,12.06 4.19,12.06 4.19,8.25 1.91,8.25
$1N334 on Top Layer: 43.81,39.87 46.1,39.87 46.1,35.94 43.81,35.94

## Text on the board
Top Silkscreen Layer: LED- | +
